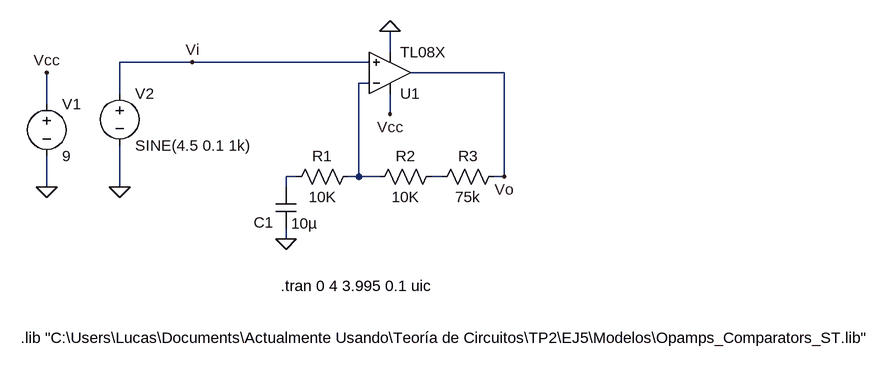
[diagram p0: schematic AmplifyingStage.asc]
AmplifyingStage.asc, the LTspice schematic file:
Version 4
SHEET 1 880 680
WIRE -2256 -1632 -2256 -1664
WIRE -2560 -1616 -2672 -1616
WIRE -2288 -1616 -2560 -1616
WIRE -2080 -1600 -2224 -1600
WIRE -2288 -1584 -2304 -1584
WIRE -2672 -1568 -2672 -1616
WIRE -2784 -1552 -2784 -1600
WIRE -2256 -1536 -2256 -1568
WIRE -2400 -1440 -2416 -1440
WIRE -2304 -1440 -2304 -1584
WIRE -2304 -1440 -2320 -1440
WIRE -2272 -1440 -2304 -1440
WIRE -2176 -1440 -2192 -1440
WIRE -2080 -1440 -2080 -1600
WIRE -2080 -1440 -2096 -1440
WIRE -2784 -1424 -2784 -1472
WIRE -2672 -1424 -2672 -1488
WIRE -2416 -1424 -2416 -1440
WIRE -2416 -1344 -2416 -1360
FLAG -2416 -1344 0
FLAG -2784 -1600 Vcc
FLAG -2784 -1424 0
FLAG -2672 -1424 0
FLAG -2080 -1440 Vo
FLAG -2560 -1616 Vi
FLAG -2256 -1664 0
FLAG -2256 -1536 Vcc
SYMBOL res -2304 -1456 R90
WINDOW 0 0 56 VBottom 2
WINDOW 3 32 56 VTop 2
SYMATTR InstName R1
SYMATTR Value 10K
SYMBOL res -2176 -1456 R90
WINDOW 0 0 56 VBottom 2
WINDOW 3 32 56 VTop 2
SYMATTR InstName R2
SYMATTR Value 10K
SYMBOL voltage -2784 -1568 R0
WINDOW 123 0 0 Left 0
WINDOW 39 0 0 Left 0
SYMATTR InstName V1
SYMATTR Value 9
SYMBOL voltage -2672 -1584 R0
WINDOW 123 0 0 Left 0
WINDOW 39 0 0 Left 0
SYMATTR InstName V2
SYMATTR Value SINE(4.5 0.1 1k)
SYMBOL res -2080 -1456 R90
WINDOW 0 0 56 VBottom 2
WINDOW 3 32 56 VTop 2
SYMATTR InstName R3
SYMATTR Value 75k
SYMBOL cap -2432 -1424 R0
WINDOW 0 -34 55 Left 2
SYMATTR InstName C1
SYMATTR Value 10µ
SYMBOL Opamps\\opamp2 -2256 -1536 M180
SYMATTR InstName U1
SYMATTR Value TL08X
TEXT -2424 -1272 Left 2 !.tran 0 4 3.995 0.1 uic
TEXT -2824 -1192 Left 2 !.lib "C:\\Users\\Lucas\\Documents\\Actualmente Usando\\Teoría de Circuitos\\TP2\\EJ5\\Modelos\\Opamps_Comparators_ST.lib"

The netlist it stands for:
* AmplifyingStage.asc
R1 N001 N002 10K
R2 N003 N001 10K
V1 Vcc 0 9
V2 Vi 0 SINE(4.5 0.1 1k)
R3 Vo N003 75k
C1 N002 0 10µ
XU1 Vi N001 Vcc 0 Vo TL08X  ; pins In+ In- V+ V- OUT
.tran 0 4 3.995 0.1 uic
.lib "C:\Users\Lucas\Documents\Actualmente Usando\Teoría de Circuitos\TP2\EJ5\Modelos\Opamps_Comparators_ST.lib"
.backanno
.end